# Altium project Fingerprintver2_1.PrjPcb
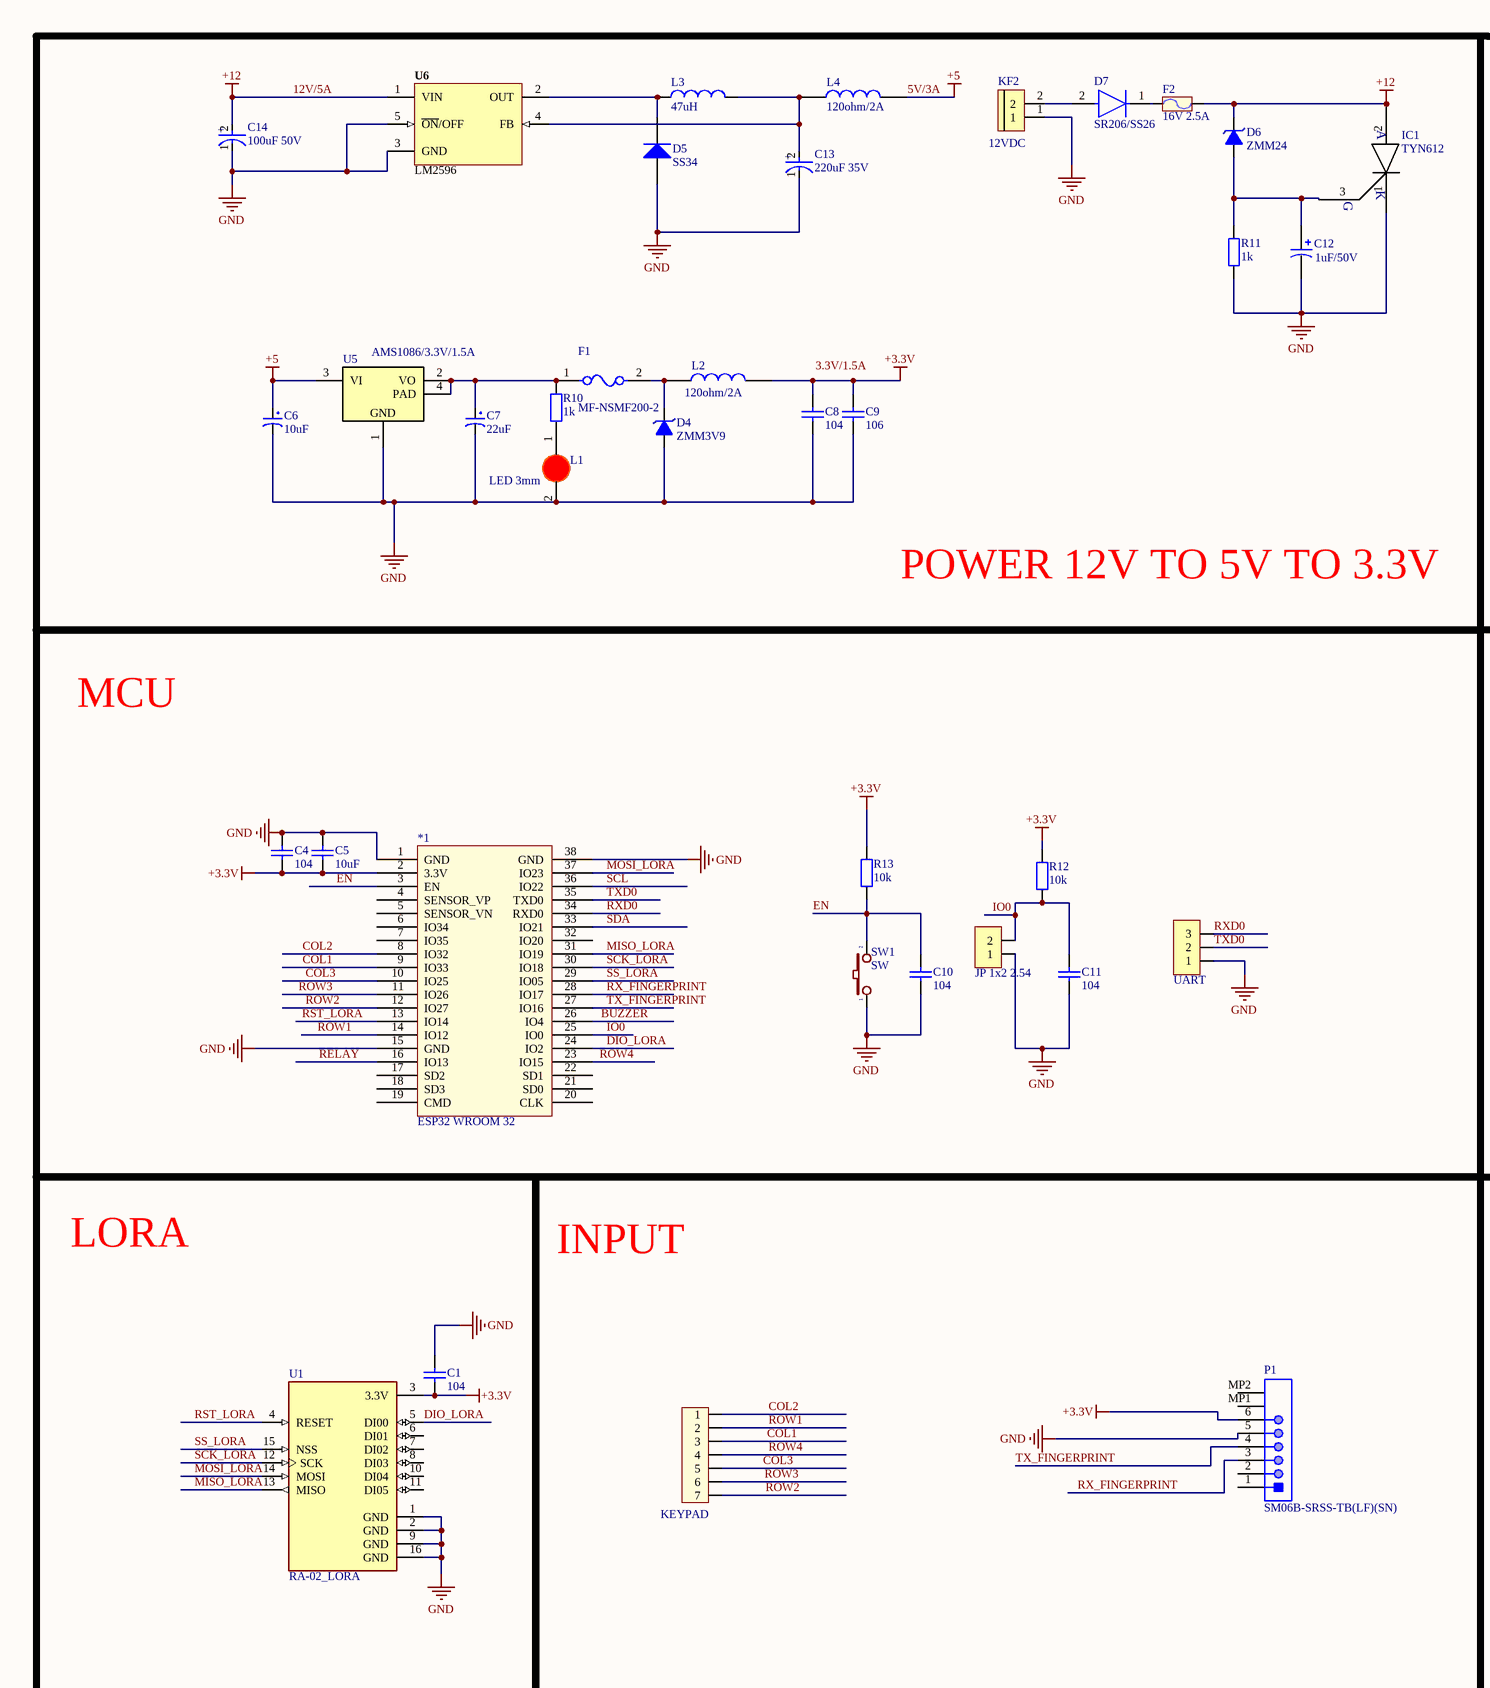
[diagram p0: schematicFingerprint.SchDoc, left]
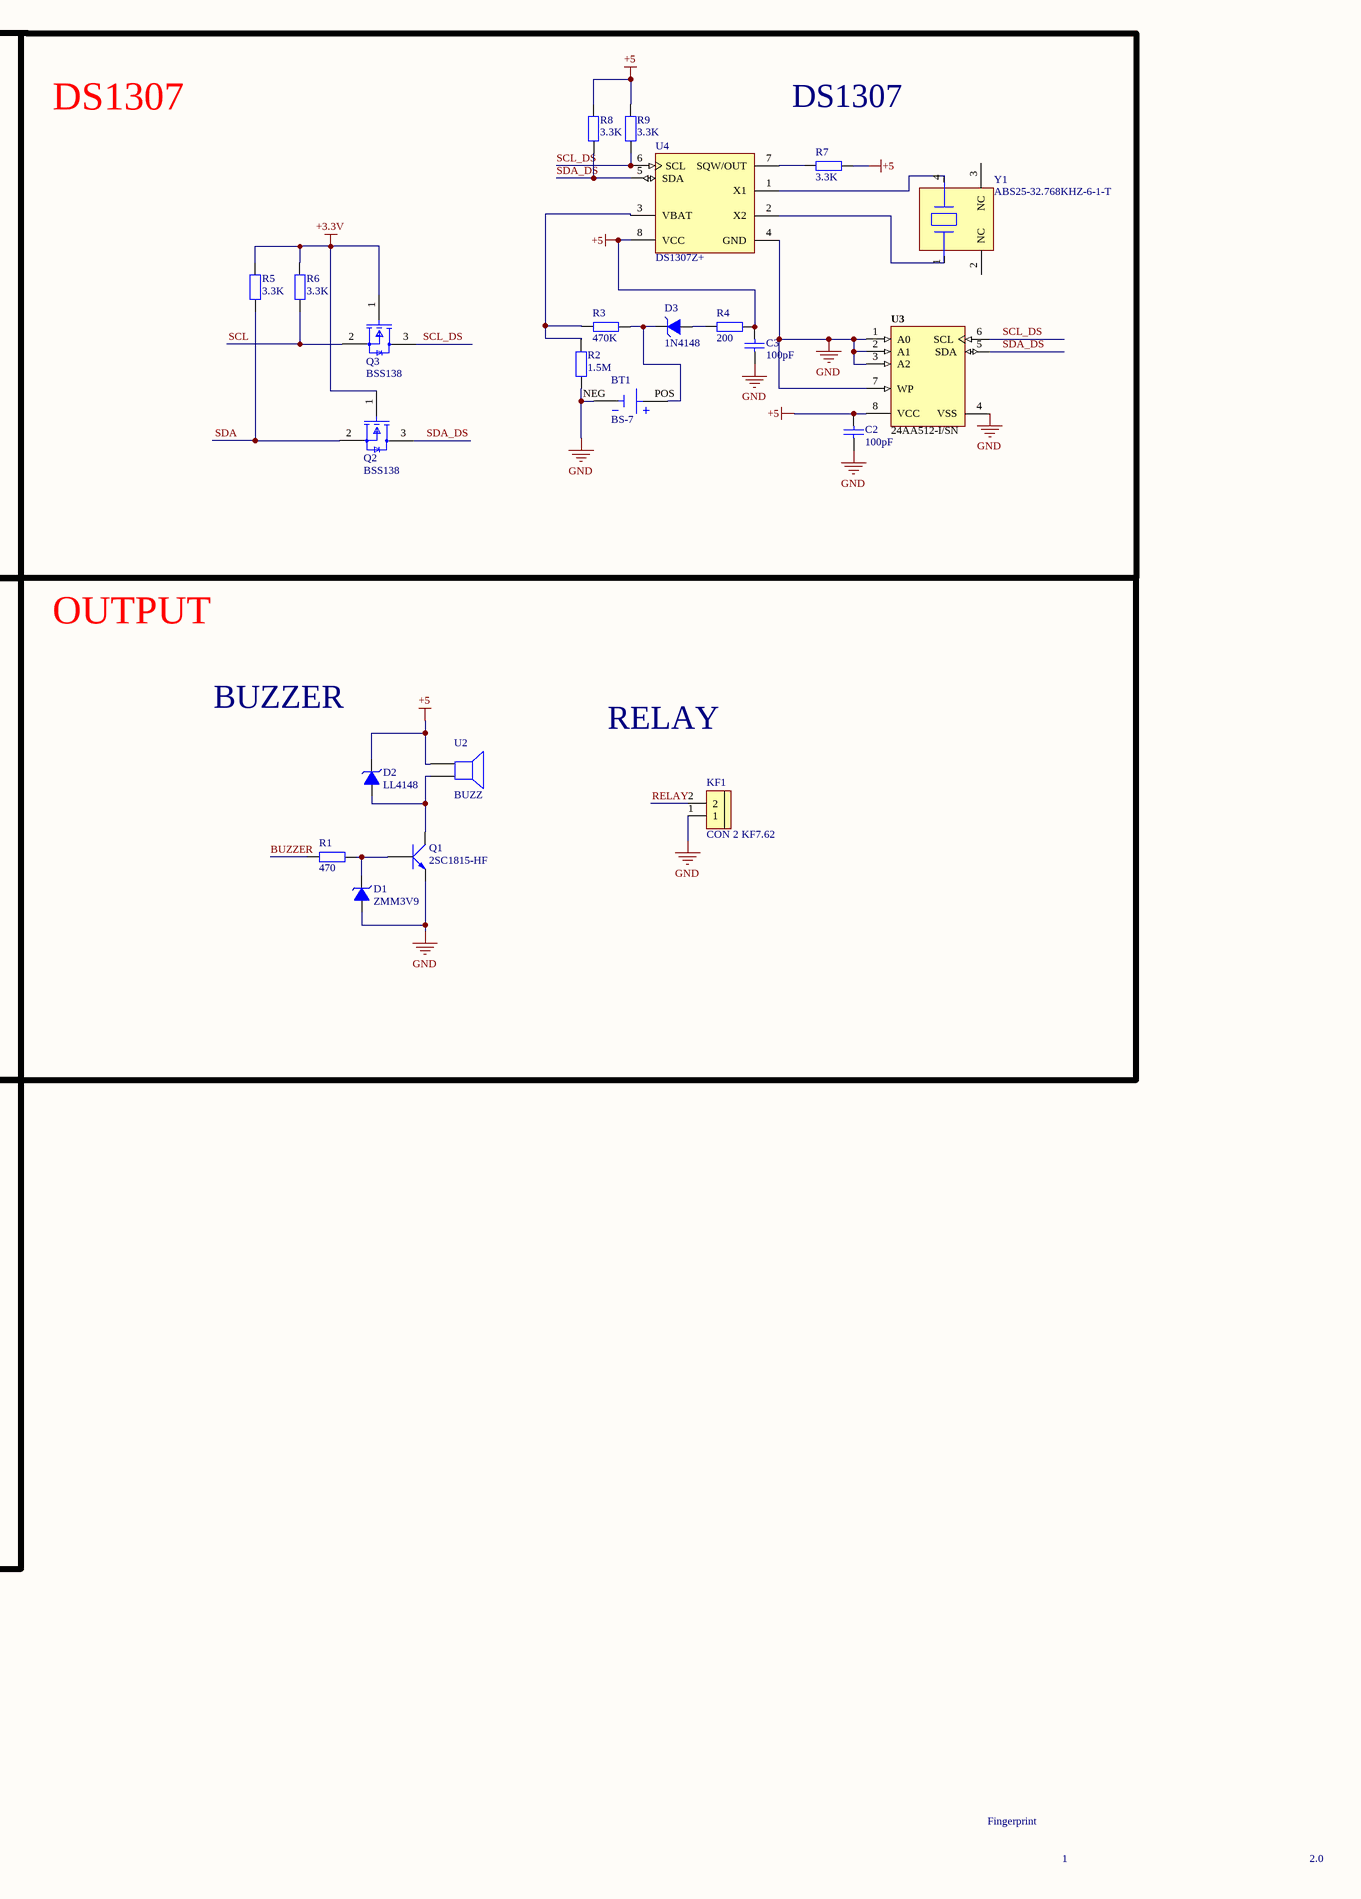
[diagram p1: schematicFingerprint.SchDoc, right]
1 sheet, 60 parts. Net scope: global (net labels, ports and power ports of the same name join across sheets).
Board file: pcbFingerprint.PcbDoc

## Sheet schematicFingerprint.SchDoc
size A2

### Parts
*1  ESP32 WROOM 32  [ESP32-WROOM-32D]
BT1  BS-7  [BAT_BS-7]
C1  104  [tu 0805]
C2  100pF  [tu 0805]
C3  100pF  [tu 0805]
C4  104  [tu 0805]
C5  10uF  [tu 0805]
C6  10uF  [tu tantalum smd6032]
C7  22uF  [tu tantalum smd6032]
C8  104  [tu 0805]
C9  106  [tu 0805]
C10  104  [tu 0805]
C11  104  [tu 0805]
C12  1uF/50V  [CAP_ALUM_SMD_4054_TYPE_B]
C13  220uF 35V  [FP-SGV8X10_5-MFG]
C14  100uF 50V  [FP-SGV8X10_5-MFG]
D1  ZMM3V9  [DIODE ZENNER SMD SOD80]
D2  LL4148  [DIODE ZENNER SMD SOD80]
D3  1N4148  [DIODE ZENNER SMD SOD80]
D4  ZMM3V9  [DIODE ZENNER SMD SOD80]
D5  SS34  [DIODE SMA]
D6  ZMM24  [DIODE ZENNER SMD SOD80]
D7  SR206/SS26  [FP-95401-MFG]
F1  MF-NSMF200-2  [FP-MF-NSMF200-2-MFG]
F2  16V 2.5A  [Cau chi tu phuc hoi 2A 24V SMD1812]
H1  KEYPAD  [Header 7P DC 2.54]
IC1  TYN612  [PCBComponent_1]
JP1  JP 1x2 2.54  [JP 1x2 DT]
JP2  UART  [JP 1x3 DT]
KF1  CON 2 KF7.62  [CON 2 KF7.62]
KF2  12VDC  [CON 2 KF7.62]
L1  LED 3mm  [LED-3MM-RED]
L2  120ohm/2A  [IND-0805 (2012)]
L3  47uH  [SUMI-CDRH127_V]
L4  120ohm/2A  [IND-0805 (2012)]
P1  SM06B-SRSS-TB(LF)(SN)  [JST-SM06B-SRSS-TB_V]
Q1  2SC1815-HF  [SOT23]
Q2  BSS138  [FP-318-08-IPC_A]
Q3  BSS138  [FP-318-08-IPC_A]
R1  470  [tro smd 0805]
R2  1.5M  [tro smd 0805]
R3  470K  [tro smd 0805]
R4  200  [tro smd 0805]
R5  3.3K  [tro smd 0805]
R6  3.3K  [tro smd 0805]
R7  3.3K  [tro smd 0805]
R8  3.3K  [tro smd 0805]
R9  3.3K  [tro smd 0805]
R10  1k  [tro smd 0805]
R11  1k  [tro smd 0805]
R12  10k  [tro smd 0805]
R13  10k  [tro smd 0805]
SW1  SW  [SW1-SMD]
U1  RA-02_LORA  [MODULE_RA-02_LORA]
U2  BUZZ  [BUZZER_through_hole]
U3  24AA512-I/SN  [SO8]
U4  DS1307Z+  [S8+2_L]
U5  AMS1086/3.3V/1.5A  [TO-263-3_102_433_181X45_SMD]
U6  LM2596  [TO263]
Y1  ABS25-32.768KHZ-6-1-T  [FP-ABS25-MFG]

### Blocks framed on the sheet
MCU: *1 C4 C5 C10 C11 JP1 JP2 R12 R13 SW1
LORA: C1 U1
INPUT: H1 P1

### Nets
5V/3A: C2.2 C3.2 C6.1 D2.2(K) L4.2 R4.2 R7.2 R8.1 R9.1 U2.1 U3.8(VCC) U4.8(VCC) U5.3(VI)  [also labelled +5]
12V/5A: C14.2(A) D6.2(K) F2.2 IC1.2(A) U6.1(VIN)  [also labelled +12]
+3.3V: *1.2(3.3V) C1.2 C4.1 C5.1 C8.1 C9.1 L2.2 P1.6 Q2.1(G) Q3.1(G) R5.1 R6.1 R12.1 R13.1 U1.3(3.3V)
GND: *1.1(GND) *1.15(GND) *1.38(GND) BT1.NEG C1.1 C2.1 C3.1 C4.2 C5.2 C6.2 C7.2 C8.2 C9.2 C10.1 C11.1 C12.2 C13.1(C) C14.1(C) D1.1(A) D4.1(A) D5.1(A) IC1.1(K) JP1.1 JP2.1 KF1.1 KF2.1 L1.2(K) P1.5 Q1.2(E) R2.2 R11.1 SW1.1 U1.1(GND) U1.2(GND) U1.9(GND) U1.16(GND) U3.1(A0) U3.2(A1) U3.3(A2) U3.4(VSS) U3.7(WP) U4.4(GND) U5.1 U6.3(GND) U6.5(~{ON}/OFF)
BUZZER: *1.26(IO4) R1.1
COL1: *1.9(IO33) H1.3
COL2: *1.8(IO32) H1.1
COL3: *1.10(IO25) H1.5
DIO_LORA: *1.24(IO2) U1.5(DI00)
EN: *1.3(EN) C10.2 R13.2 SW1.2
IO0: *1.25(IO0) C11.2 JP1.2 R12.2
MISO_LORA: *1.31(IO19) U1.13(MISO)
MOSI_LORA: *1.37(IO23) U1.14(MOSI)
RELAY: *1.16(IO13) KF1.2
ROW1: *1.14(IO12) H1.2
ROW2: *1.12(IO27) H1.7
ROW3: *1.11(IO26) H1.6
ROW4: *1.23(IO15) H1.4
RST_LORA: *1.13(IO14) U1.4(RESET)
RX_FINGERPRINT: *1.28(IO17) P1.3
RXD0: *1.34(RXD0) JP2.3
SCK_LORA: *1.30(IO18) U1.12(SCK)
SCL: *1.36(IO22) Q3.2(S) R6.2
SCL_DS: Q3.3(D) R9.2 U3.6(SCL) U4.6(SCL)
SDA: *1.33(IO21) Q2.2(S) R5.2
SDA_DS: Q2.3(D) R8.2 U3.5(SDA) U4.5(SDA)
SS_LORA: *1.29(IO05) U1.15(NSS)
TX_FINGERPRINT: *1.27(IO16) P1.4
TXD0: *1.35(TXD0) JP2.2
NetBT1_POS: BT1.POS D3.2(K) R3.2
NetC7_1: C7.1 F1.1 R10.1 U5.2(VO) U5.4(PAD)
NetC12_1: C12.1 D6.1(A) IC1.3(G) R11.2
NetC13_2: C13.2(A) L3.2 L4.1 U6.4(FB)
NetD1_2: D1.2(K) Q1.1(B) R1.2
NetD2_1: D2.1(A) Q1.3(C) U2.2
NetD3_1: D3.1(A) R4.1
NetD4_2: D4.2(K) F1.2 L2.1
NetD5_2: D5.2(K) L3.1 U6.2(OUT)
NetD7_1: D7.1(C) F2.1
NetD7_2: D7.2(A) KF2.2
NetL1_1: L1.1(A) R10.2
NetR2_1: R2.1 R3.1 U4.3(VBAT)
NetR7_1: R7.1 U4.7(SQW/OUT)
NetU4_1: U4.1(X1) Y1.4
NetU4_2: U4.2(X2) Y1.1

Not connected (* = marked no-connect by the designer): *1 4(SENSOR_VP) 5(SENSOR_VN) 6(IO34) 7(IO35) 17(SD2) 18(SD3) 19(CMD) 20(CLK) 21(SD0) 22(SD1) 32(IO20); P1 1 2 MP1 MP2; U1 6(DI01) 7(DI02) 8(DI03) 10(DI04) 11(DI05); Y1 2(NC) 3(NC)

### Notes on the sheet
- DS1307
- POWER 12V TO 5V TO 3.3V
- OUTPUT
- BUZZER
- RELAY
- Fingerprint
- 1
- 2.0
- Labels drawn without touching a wire or pin: 3.3V/1.5A
- (in symbol CMP-35376-000016-1) +
- (in symbol REG_27V-3.3V-5A-30W-TO-263_1) GND

### Library data of the parts
BT1 = BS-7: BATTERY HOLDER COIN 20MM PC PIN; MF: MPD _Memory; Value: *; SnapEDA_Link: https://www.snapeda.com/parts/BS-7/MPD%20%28Memory%20Protection%20Devices%29/view-part/4219629/?ref=snap; MP: BS-7; Availability: Unavailable; Price: None; Package: None
C1-C5 C8 C10 C11 = Tu 0805 104 50V 10%: Dán; Don_Vi: Con; So_Chan: 2; Ten_Linh_Kien: Tụ 0805 104-100nF 10% 50V; Ma_Hang: MH004551; Chung_Loai: Dán; Kieu_Chan: *
  C1 C4 C5 C10 C11: ComponentLink1Description: New link; ComponentLink1URL: https://www.thegioiic.com/tu-gom-0805-100nf-0-1uf-50v
  C2 C3: ComponentLink1Description: New link; ComponentLink1URL: https://www.thegioiic.com/tu-gom-0805-100pf-50v
C6 = Tu tantalum 10uF 35V SMD6032: Dán; Don_Vi: Con; So_Chan: 2; Ten_Linh_Kien: Tụ tantalum 106V-10uF 35V SMD6032; Ma_Hang: MH007593; Chung_Loai: Dán; Kieu_Chan: *
C7 = Tu tantalum 22uF 25V SMD6032: Dán; Don_Vi: Con; So_Chan: 2; Ten_Linh_Kien: Tụ tantalum 226E-22uF 25V SMD6032; Ma_Hang: MH002651; Chung_Loai: Dán; Kieu_Chan: *
C9 = Tu 0805 106 16V 10%: Dán; Ten_Linh_Kien: Tụ 0805 106-10uF 10% 16V; So_Chan: 2; Don_Vi: Con; Ma_Hang: MH004553; Chung_Loai: Dán; Kieu_Chan: *
C12 = EEE-HA1C100P: CAP ALUM 10uF 20% 16V SMD; MFR: Panasonic; Value: 10uF/16V; Solder: SMT; MPN: EEE-HA1C100P; Category: CAPACITOR; PinCount: 2; ComponentLink1Description: New link; ComponentLink1URL: https://www.thegioiic.com/tu-nhom-smd-1uf-50v-4x5-4mm
C13 C14 = CMP-35376-000016-1: CAP ALUM 100UF 20% 50V SMD; Life (Hours): 2000Hour; Ripple Current: 230mA; Leakage Current: 3uA; Lead Diameter: 1.1mm; Min Operating Temperature: -55°C; Mount: Surface Mount; Voltage Rating: 50V; Series: SGV; Case/Package: Radial; RoHS Compliant: Yes; Package Quantity: 500; Max Operating Temperature: 105°C; Height: 10.5mm; Packaging: Tape and Reel; Construction: Cylindrical; Voltage: 50V; Diameter: 8mm; Lead Pitch: 3.1mm; Tolerance: 20%; Termination: SMD/SMT; Height - Seated (Max): 0.413inch; Lead Free: Lead Free; Capacitance: 100uF; Radiation Hardening: No
D1-D4 = Diode Zener 3.3V: Dán; Don_Vi: Con; Ma_Hang: MH002880; Ten_Linh_Kien: Diode Zener 1/2W 3.3V SMD1206 ZMM3.3; Kieu_Chan: *; Ghi_Chu: *; Chung_Loai: Dán
  D3: ComponentLink1Description: New link; ComponentLink1URL: https://www.thegioiic.com/ll4148-diode-chinh-luu-0-2a-100v
D5 = Diode SS34 ( 1N5822 ): Dán; Don_Vi: Con; Ma_Hang: MH002104; Ten_Linh_Kien: Diode SS34 3A 40V SMA ( 1N5822 SS34A); Kieu_Chan: *; Chung_Loai: Dán
D6 = Diode Zener 15V: Dán; Don_Vi: Con; Ma_Hang: MH002883; Ten_Linh_Kien: Diode Zener 1/2W 15V SMD1206 ZMM15; Ghi_Chu: *; Chung_Loai: Dán; Kieu_Chan: *; ComponentLink1Description: New link; ComponentLink1URL: https://www.thegioiic.com/zmm24-diode-zener-24v-500mw-smd
D7 = CMP-02540-000056-1: DIODE GEN PURP 600V 2A DO214AA; Output Current: 1A; Element Configuration: Single; Max Forward Surge Current (Ifsm): 35A; Recovery Time: 75ns; Reverse Recovery Time-Max: 50ns; Forward Voltage: 1.25V; Max Reverse Current: 5uA; Polarity: Standard; Width: 3.94mm; Voltage Rating (DC): 600V; Case/Package: SMB; Packaging: Tape and Reel; Length: 4.57mm; Max Operating Temperature: 175°C; Package Quantity: 750; Lead Free: Lead Free; Max Reverse Voltage (DC): 600V; Mount: Surface Mount; Peak Non-Repetitive Surge Current: 35A; Max Repetitive Reverse Voltage (Vrrm): 600V; Reverse Voltage: 600V; Forward Current: 1A; Max Surge Current: 35A; Series: -; Radiation Hardening: No; Current Rating: 1A; Min Operating Temperature: -65°C; Reverse Recovery Time: 75ns; Number of Pins: 2; Average Rectified Current: 2A; Height: 2.24mm; ComponentLink1Description: New link; ComponentLink1URL: https://www.thegioiic.com/ss26-smb-diode-schottky-2a
F1 = CMP-07400-000004-1: PTC RESET FUSE 6V 2A 1206; Manufacturer: Bourns Inc.; Trip Time: 1s; Automotive Grade: Grade 3; Value: 85mΩ; Trip Current: 4A; Current Rating: 100A; RoHS: TRUE; Device Class L1: Circuit Protection; Manufacturer Part Number: MF-NSMF200-2; Height: 1.6mm; Device Class L3: unset; Ambient Temperature Range Low: -40°C; ComponentLink2URL: https://bourns.com/docs/product-datasheets/mfnsmf.pdf?sfvrsn=39c76af6_14; Lead Free: Yes; Temperature Range High: +85°C; Temperature Range Low: -40°C; Octopart: https://octopart.com/mf-nsmf200-2-bourns-90790; Ipc Land Pattern Name: CAPC325160X115; Device Class L2: PTC Resettable Fuses; ComponentLink2Description: Datasheet; Package: MF-NSMF200-2; Voltage Rating: 6V; Mouser Description: Resettable Fuses - PPTC 2V 6V 0.02ohm (R); Ambient Temperature Range High: +85°C; Hold Current: 2A; Digikey Description: PTC RESET FUSE 6V 2A 1206; Category: Fuse; Temperature: -40°C to +85°C; Automotive: Yes; Resistance: 85mΩ
F2 = Cau chi tu phuc hoi 2A 24V SMD1812: 2A 24V SMD1812; Ma_Hang: MH010033; Ten: Cầu Chì Tự Phục Hồi 2A 24V SMD1812
H1 = Header 7P 2.54 Duc Cong: Cắm; Ten_Linh_Kien: Header 7P XH2.54-7P Đực Cong; Don_Vi: Con; Ma_Hang: MH004118; Chung_Loai: Cắm
JP1 = JP 1x2 2.54 Duc Thang: Cắm; Ten_Linh_Kien: Jump Đơn Đực 2.54MM 1x40P Thẳng 11MM; Don_Vi: Con; Ma_Hang: MH000903; Ghi_Chu: *; Kieu_Chan: *; Chung_Loai: Cắm
JP2 = JP 1x3 2.54 Duc Thang: Cắm; Ten_Linh_Kien: Jump Đơn Đực 2.54MM 1x40P Thẳng 11MM; Don_Vi: Con; Ma_Hang: MH000903; Ghi_Chu: *; Kieu_Chan: *; Chung_Loai: Cắm
KF1 = CON 2 KF7.62: Cắm; Ma_Hang: MH002053; Ten_Linh_Kien: CON 2 KF7.62-2P 7.62MM (Đen Thẳng); Chung_Loai: Cắm; Ghi_Chu: *; Kieu_Chan: *; Don_Vi: Con; ComponentLink1Description: New link; ComponentLink1URL: https://www.thegioiic.com/kf7-62-2-terminal-khoi-han-pcb-2-cuc-20a-300v-7-62mm
KF2 = CON 2 KF7.62: Cắm; Ma_Hang: MH002053; Ten_Linh_Kien: CON 2 KF7.62-2P 7.62MM (Đen Thẳng); Don_Vi: Con; Chung_Loai: Cắm; Ghi_Chu: *; Kieu_Chan: *; ComponentLink1Description: New link; ComponentLink1URL: https://www.thegioiic.com/kf7-62-2-terminal-khoi-han-pcb-2-cuc-20a-300v-7-62mm
L1 = LED 3mm Do: Cắm; Don_Vi: Con; Ma_Hang: MH003892; Ten_Linh_Kien: Led 3MM Phủ Đỏ (10c); Ghi_Chu: *; Kieu_Chan: *; Chung_Loai: Cắm; ComponentLink1Description: New link; ComponentLink1URL: https://www.thegioiic.com/led-do-3mm-sieu-sang-dau-tron-trong-suot-chan-dai
L2 L4 = 742792042: 2A 120 OHM 0805; CompanyID: VT-01115; Solder: SMT; Value: 600OHM/200mA; MPN: 742792042; Category: FERRITE BEAD; PinCount: 2
L3 = CMP-2000-06084-1: Power Inductor, 10 uH, +/- 20%, -40 to 100 degC, 2-Pin SMD, RoHS, Tape and Reel; Manufacturer: Sumida; Catalog Drawings: CDRH127SeriesFrontCDRH127SeriesSideCDRH127SeriesBottom; Product Training Modules: PowerInductorBasics; Current Rating: 5.4A; Shielding: Shielded; Online Catalog: CDRHSeries; DC Resistance (DCR): 21.6mOhmMax; Other Names: 308-1457-1; Inductance: 10µH; Frequency - Test: 1kHz; Mounting Type: SurfaceMount; Datasheet Version: 01/2014; Package Description: 2-Pin Surface Mount Device, Body 12 x 12 mm; Frequency - Self Resonant: -; Package Reference: CDRH127; Category: Inductors,Coils,Chokes; Material - Core: -; Q @ Freq: -; Type: -; Family: FixedInductors; Ratings: -; Series: CDRH127; Manufacturer URL: http://www.sumida.com/; Operating Temperature: -40°C~100°C; Height - Seated (Max): 0.315"(8.00mm); Standard Package: 1; Size / Dimension: 0.472"Lx0.472"W(12.00mmx12.00mm); Current - Saturation: -; Datasheet URL: http://products.sumida.com/products/pdf/CDRH127.pdf; Package / Case: Nonstandard; Tolerance: ±20%; Mounting Technology: SurfaceMount; Packaging: CutTape(CT)
P1 = CMP-2000-07080-1: Male Header, Pitch 1 mm, 1 x 6 Position, Height 2.95 mm, -25 to 85 degC, RoHS, Tape and Reel; Manufacturer: JST; No of Positions: 6; Pitch: 1mm; Style/Orientation: RightAngleHeader/Plug; Datasheet URL: https://datasheet.ciiva.com/26894/getdatasheetpartid-708885-26894671.pdf; Package Description: Male Header, Pitch 1 mm, 1 X 6 Position, Height 2.9 mm; Termination: Solder; Manufacturer URL: http://www.jst.com/home2.html; Type: ShroudedHeader; Package Reference: SM06B-SRSS-TB; Datasheet Version: 11/2010; Mounting Technology: SurfaceMount
Q1 = C1815 HF SMD: NPN transistor; Value: C9014
Q2 Q3 = CMP-07173-000101-1: MOSFET N-CH 50V 220MA SOT-23; Turn-Off Delay Time: 20ns; Element Configuration: Single; Rds On Max: 3.5R; Gate to Source Voltage (Vgs): 20V; Threshold Voltage: 1.3V; Number of Elements: 1; Power Dissipation: 360mW; Rise Time: 9ns; Turn-On Delay Time: 2.5ns; Input Capacitance: 27pF; On-State Resistance: 6R; Lead Free: Lead Free; Length: 2.92mm; Width: 1.3mm; Drain to Source Breakdown Voltage: 50V; Min Operating Temperature: -55°C; REACH SVHC: No SVHC; Packaging: Tape and Reel; Radiation Hardening: No; Height: 0.93mm; Drain to Source Voltage (Vdss): 50V; Current Rating: 220mA; Voltage Rating (DC): 50V; Weight: 0.03g; Continuous Drain Current (ID): 220mA; Number of Pins: 3; Nominal Vgs: 1.3V; Max Power Dissipation: 360mW; Fall Time: 9ns; Drain to Source Resistance: 3.5R; Contact Plating: Tin; Case/Package: SOT-23; Package Quantity: 1; Dual Supply Voltage: 50V; Mount: Surface Mount; Termination: SMD/SMT; Max Operating Temperature: 150°C
R1 = Tro 0805 1% 470k: Dán; Don_Vi: Con; So_Chan: 2; Ten_Linh_Kien: Trở 0805 1% 470k; Ma_Hang: MH005485; Chung_Loai: Dán; Kieu_Chan: *; ComponentLink1Description: New link; ComponentLink1URL: https://www.thegioiic.com/dien-tro-470-ohm-0805-1-
R2-R9 R12 R13 = Tro 0805 5% 10k: Dán; Don_Vi: Con; So_Chan: 2; Ten_Linh_Kien: Trở 0805 5% 10k; Ma_Hang: MH005239; Chung_Loai: Dán; Kieu_Chan: *; ComponentLink1Description: New link
  R2: ComponentLink1URL: https://www.thegioiic.com/dien-tro-1-5-mohm-0805-5
  R3: ComponentLink1URL: https://www.thegioiic.com/dien-tro-470-kohm-0805-1
  R4: ComponentLink1URL: https://www.thegioiic.com/dien-tro-200-ohm-0805-5
  R5-R9: ComponentLink1URL: https://www.thegioiic.com/dien-tro-3-3-kohm-0805-1-
  R12 R13: ComponentLink1URL: https://www.thegioiic.com/dien-tro-10-kohm-0805-5
R10 R11 = Tro 0805 1% 1k: Dán; Don_Vi: Con; So_Chan: 2; Ten_Linh_Kien: Trở 0805 1% 1k; Ma_Hang: MH005468; Chung_Loai: Dán; Kieu_Chan: *; ComponentLink1Description: New link; ComponentLink1URL: https://www.thegioiic.com/dien-tro-1-kohm-0805-1
SW1 = SW2: Switch button 2 pin; Value: SW chip 2 pin; ComponentLink1Description: New link; ComponentLink1URL: https://www.thegioiic.com/nut-nhan-3-5x6mm-cao-2-5mm-2-chan-smd-dau-trang
U1 = RA-02_LORA: Ra-02 LoRa RF M5Stack Platform Evaluation Expansion Board; MF: AI-Thinker; Package: None; Check_prices: https://www.snapeda.com/parts/Ra-02%20LoRa/AI-Thinker/view-part/?ref=eda; Value: *; MP: Ra-02 LoRa; Availability: Not in stock; SnapEDA_Link: https://www.snapeda.com/parts/Ra-02%20LoRa/AI-Thinker/view-part/?ref=snap; Price: None
U2 = Speaker: Loudspeaker
U3 = 24-AA-FC512-SOIC-TSSOP-8: 512K bits I2C™ Serial EEPROM, 1.7 to 5.5 V, 400 kHz, -40 to 85 degC, 8-pin SOIC (SN8), Tube; Manufacturer: Microchip; PackageDescription: 8-Lead Plastic Small Outline, 4.9 x 3.9 mm Body, 1.27 mm Pitch; PackageReference: SOIC-SN8; Mounting Technology: Surface Mount; DatasheetVersion: Rev. M; PartNumber: 24AA512-I/SN; PackageVersion: C04-057C; ComponentLink1Description: New link; ComponentLink1URL: https://www.thegioiic.com/cat24c32wi-gt3-ic-eeprom-32kbit-8-soic
U4 = CMP-0254-00308-1: 64 x 8, Serial, I2C Real-Time Clock, 5.0V, 8-Pin SO, 0 to 70 degC, Pb-Free; DatasheetVersion: 10-Feb-2008; Code_IPC: SOIC127P600-8; Code_JEDEC: MS-012-AA; PackageReference: S8+2; PackageDescription: 8-Pin Small-Outline IC, Narrow (0.15in), 1.27 mm Pitch, SOIC (N), Pb-Free; PackageVersion: revC, 2010; ComponentLink4Description: New link; ComponentLink4URL: https://www.thegioiic.com/ds1307z-ic-rtc-clock-calendar-56b-8-soic
U5 = REG_27V-3.3V-5A-30W-TO-263_1: Linear Voltage Regulator IC 1 Output 5A DDPAK/TO-263-3; Manufacturer: STMicroelectronics; Manufacturer Part Number: LM1084ISX-3.3/NOPB; Alternate Part Number-1: NA; Case/Package: TO-263; Supplier-1: Mouser; Supplier Part Number-1: 926-LM1084ISX33NOPB
U6 = LM2596: Max Input Voltage: 12 V; Max Output Current: 3 (6.0 peak) A; Max Output Voltage: mV; Category: IC-Power; Min Input Voltage: mV; Min Output Voltage: mV; Mounting Technology: Surface Mount; Status: Unreleased; Supply Voltage: mV; Temperature Range: -40 to +125 degC
Y1 = CMP-27762-013076-1: CRYSTAL 32.7680KHZ 6PF SMD; ESR (Equivalent Series Resistance): 50kR; Frequency Tolerance: 10ppm; Series Resistance: 50kR; Frequency: 32.768kHz; Length: 8mm; Load Capacitance: 6pF; Packaging: Tape and Reel; Radiation Hardening: No; Min Operating Temperature: -40°C; Lead Free: Lead Free; Height: 0.098inch; Termination: SMD/SMT; Case/Package: SMD/SMT; Max Operating Temperature: 85°C; Mount: Surface Mount; Depth: 3.8mm; RoHS Compliant: Yes; Series: ABS25; Package Quantity: 3000; Operating Frequency: 32.768 kHz; Number of Pins: 4; Tolerance: 10ppm; Width: 0.15inch; REACH SVHC: No SVHC